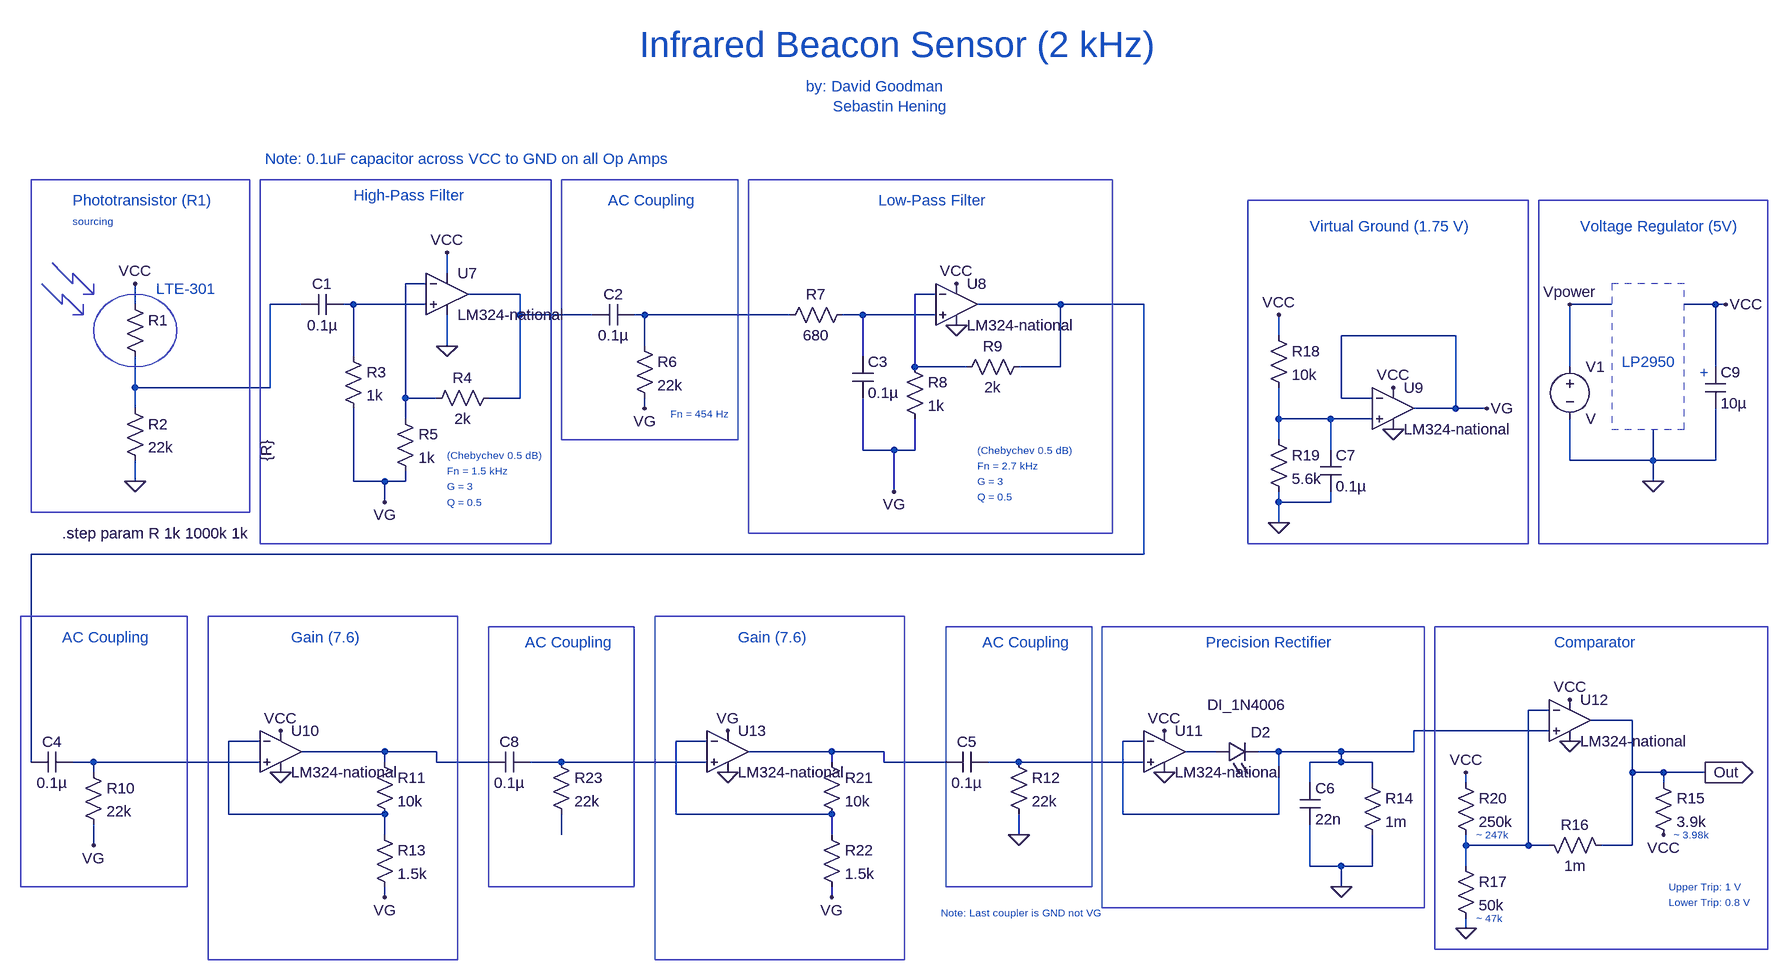
[diagram p0: schematic infrared_sensor.asc]
infrared_sensor.asc, the LTspice schematic file:
Version 4
SHEET 1 2516 1336
WIRE 448 192 448 160
WIRE 416 208 384 208
WIRE 560 224 480 224
WIRE 1200 224 1168 224
WIRE -32 240 -32 208
WIRE 224 240 176 240
WIRE 304 240 288 240
WIRE 416 240 304 240
WIRE 1392 240 1264 240
WIRE 1520 240 1392 240
WIRE 2240 240 2176 240
WIRE 2400 240 2352 240
WIRE 2416 240 2400 240
WIRE 560 256 560 224
WIRE 672 256 560 256
WIRE 752 256 736 256
WIRE 976 256 752 256
WIRE 1088 256 1056 256
WIRE 1200 256 1088 256
WIRE 1728 288 1728 256
WIRE 2000 288 1824 288
WIRE 448 304 448 256
WIRE 752 304 752 256
WIRE 304 320 304 240
WIRE 1088 320 1088 256
WIRE 1168 336 1168 224
WIRE 1248 336 1168 336
WIRE 1392 336 1392 240
WIRE 1392 336 1328 336
WIRE 2176 336 2176 240
WIRE 2400 336 2400 240
WIRE -32 368 -32 320
WIRE 176 368 176 240
WIRE 176 368 -32 368
WIRE 384 384 384 208
WIRE 432 384 384 384
WIRE 560 384 560 256
WIRE 560 384 512 384
WIRE 1824 384 1824 288
WIRE 1872 384 1824 384
WIRE -32 400 -32 368
WIRE 752 400 752 384
WIRE 2000 400 2000 288
WIRE 2000 400 1936 400
WIRE 2048 400 2000 400
WIRE 384 416 384 384
WIRE 1728 416 1728 368
WIRE 1808 416 1728 416
WIRE 1872 416 1808 416
WIRE 1728 448 1728 416
WIRE 1088 464 1088 384
WIRE 1136 464 1088 464
WIRE 1168 464 1168 416
WIRE 1168 464 1136 464
WIRE 1808 464 1808 416
WIRE 2176 480 2176 416
WIRE 2304 480 2304 432
WIRE 2304 480 2176 480
WIRE 2400 480 2400 400
WIRE 2400 480 2304 480
WIRE -32 512 -32 480
WIRE 304 512 304 400
WIRE 352 512 304 512
WIRE 384 512 384 496
WIRE 384 512 352 512
WIRE 2304 512 2304 480
WIRE 1136 528 1136 464
WIRE 352 544 352 512
WIRE 1728 544 1728 528
WIRE 1808 544 1808 528
WIRE 1808 544 1728 544
WIRE 1728 576 1728 544
WIRE 1520 624 1520 240
WIRE 1520 624 -192 624
WIRE 2144 864 2112 864
WIRE 2272 880 2208 880
WIRE 2144 896 1936 896
WIRE 160 912 112 912
WIRE 848 912 800 912
WIRE 1520 912 1488 912
WIRE 352 928 224 928
WIRE 432 928 352 928
WIRE 1040 928 912 928
WIRE 1120 928 1040 928
WIRE 1632 928 1584 928
WIRE 1728 928 1696 928
WIRE 1824 928 1728 928
WIRE 1936 928 1936 896
WIRE 1936 928 1824 928
WIRE -192 944 -192 624
WIRE -96 944 -128 944
WIRE 160 944 -96 944
WIRE 352 944 352 928
WIRE 432 944 432 928
WIRE 512 944 432 944
WIRE 624 944 576 944
WIRE 848 944 624 944
WIRE 1040 944 1040 928
WIRE 1120 944 1120 928
WIRE 1216 944 1120 944
WIRE 1328 944 1280 944
WIRE 1520 944 1328 944
WIRE 1824 944 1824 928
WIRE 1824 944 1776 944
WIRE 1872 944 1824 944
WIRE -96 960 -96 944
WIRE 2272 960 2272 880
WIRE 2320 960 2272 960
WIRE 2384 960 2320 960
WIRE 1776 976 1776 944
WIRE 1872 976 1872 944
WIRE 2016 976 2016 960
WIRE 2320 976 2320 960
WIRE 112 1024 112 912
WIRE 352 1024 112 1024
WIRE 800 1024 800 912
WIRE 1040 1024 800 1024
WIRE 1488 1024 1488 912
WIRE 1728 1024 1728 928
WIRE 1728 1024 1488 1024
WIRE 352 1056 352 1024
WIRE 624 1056 624 1024
WIRE 1040 1056 1040 1024
WIRE 1328 1056 1328 1024
WIRE -96 1072 -96 1040
WIRE 2016 1072 2016 1056
WIRE 2112 1072 2112 864
WIRE 2112 1072 2016 1072
WIRE 2144 1072 2112 1072
WIRE 2272 1072 2272 960
WIRE 2272 1072 2224 1072
WIRE 1776 1104 1776 1040
WIRE 1824 1104 1776 1104
WIRE 1872 1104 1872 1056
WIRE 1872 1104 1824 1104
WIRE 2016 1104 2016 1072
WIRE 1824 1136 1824 1104
WIRE 352 1152 352 1136
WIRE 1040 1152 1040 1136
WIRE 2016 1200 2016 1184
FLAG 352 544 VG
FLAG 1136 528 VG
FLAG -96 1072 VG
FLAG 752 400 VG
FLAG 352 1152 VG
FLAG 1824 1136 0
FLAG 2016 1200 0
FLAG 2320 1056 VCC
FLAG 2176 848 VCC
FLAG 1552 896 VCC
FLAG 1552 960 0
FLAG 2176 912 0
FLAG 192 960 0
FLAG 192 896 VCC
FLAG 1232 208 VCC
FLAG 448 160 VCC
FLAG 448 304 0
FLAG 1232 272 0
FLAG 2384 960 Out
IOPIN 2384 960 Out
FLAG -32 512 0
FLAG -32 208 VCC
FLAG 1728 576 0
FLAG 1728 256 VCC
FLAG 1904 432 0
FLAG 2048 400 VG
FLAG 2016 960 VCC
FLAG 1040 1152 VG
FLAG 880 960 0
FLAG 880 896 VG
FLAG 2416 240 VCC
FLAG 1328 1056 0
FLAG 2304 512 0
FLAG 1904 368 VCC
FLAG 2176 240 Vpower
SYMBOL res -48 224 R0
WINDOW 3 218 258 VLeft 2
SYMATTR Value {R}
SYMATTR InstName R1
SYMBOL res -48 384 R0
SYMATTR InstName R2
SYMATTR Value 22k
SYMBOL cap 288 224 R90
WINDOW 0 0 32 VBottom 2
WINDOW 3 32 32 VTop 2
SYMATTR InstName C1
SYMATTR Value 0.1µ
SYMBOL res 288 304 R0
SYMATTR InstName R3
SYMATTR Value 1k
SYMBOL res 528 368 R90
WINDOW 0 0 56 VBottom 2
WINDOW 3 32 56 VTop 2
SYMATTR InstName R4
SYMATTR Value 2k
SYMBOL res 368 400 R0
SYMATTR InstName R5
SYMATTR Value 1k
SYMBOL cap 736 240 R90
WINDOW 0 0 32 VBottom 2
WINDOW 3 32 32 VTop 2
SYMATTR InstName C2
SYMATTR Value 0.1µ
SYMBOL res 736 288 R0
SYMATTR InstName R6
SYMATTR Value 22k
SYMBOL res 1072 240 R90
WINDOW 0 0 56 VBottom 2
WINDOW 3 32 56 VTop 2
SYMATTR InstName R7
SYMATTR Value 680
SYMBOL cap 1072 320 R0
SYMATTR InstName C3
SYMATTR Value 0.1µ
SYMBOL res 1152 320 R0
SYMATTR InstName R8
SYMATTR Value 1k
SYMBOL res 1344 320 R90
WINDOW 0 0 56 VBottom 2
WINDOW 3 32 56 VTop 2
SYMATTR InstName R9
SYMATTR Value 2k
SYMBOL cap -192 928 M90
WINDOW 0 0 32 VBottom 2
WINDOW 3 32 32 VTop 2
SYMATTR InstName C4
SYMATTR Value 0.1µ
SYMBOL res -112 944 R0
SYMATTR InstName R10
SYMATTR Value 22k
SYMBOL res 336 928 R0
SYMATTR InstName R11
SYMATTR Value 10k
SYMBOL cap 1216 928 M90
WINDOW 0 0 32 VBottom 2
WINDOW 3 32 32 VTop 2
SYMATTR InstName C5
SYMATTR Value 0.1µ
SYMBOL res 1312 928 R0
SYMATTR InstName R12
SYMATTR Value 22k
SYMBOL res 336 1040 R0
SYMATTR InstName R13
SYMATTR Value 1.5k
SYMBOL LED 1632 944 R270
WINDOW 0 30 68 VTop 2
WINDOW 3 104 47 VBottom 2
SYMATTR InstName D2
SYMATTR Value DI_1N4006
SYMATTR Description Diode
SYMATTR Type diode
SYMBOL cap 1760 976 R0
SYMATTR InstName C6
SYMATTR Value 22n
SYMBOL res 1856 960 R0
SYMATTR InstName R14
SYMATTR Value 1m
SYMBOL res 2304 960 R0
SYMATTR InstName R15
SYMATTR Value 3.9k
SYMBOL res 2128 1056 M90
WINDOW 0 0 56 VBottom 2
WINDOW 3 32 56 VTop 2
SYMATTR InstName R16
SYMATTR Value 1m
SYMBOL res 2000 1088 R0
SYMATTR InstName R17
SYMATTR Value 50k
SYMBOL res 1712 272 R0
SYMATTR InstName R18
SYMATTR Value 10k
SYMBOL res 1712 432 R0
SYMATTR InstName R19
SYMATTR Value 5.6k
SYMBOL res 2000 960 R0
SYMATTR InstName R20
SYMATTR Value 250k
SYMBOL cap 1792 464 R0
SYMATTR InstName C7
SYMATTR Value 0.1µ
SYMBOL LM324-national 448 160 R0
SYMATTR InstName U7
SYMBOL LM324-national 1232 176 R0
SYMATTR InstName U8
SYMBOL LM324-national 1904 336 R0
SYMATTR InstName U9
SYMBOL LM324-national 192 864 R0
SYMATTR InstName U10
SYMBOL LM324-national 1552 864 R0
SYMATTR InstName U11
SYMBOL LM324-national 2176 816 R0
SYMATTR InstName U12
SYMBOL res 1024 928 R0
SYMATTR InstName R21
SYMATTR Value 10k
SYMBOL res 1024 1040 R0
SYMATTR InstName R22
SYMATTR Value 1.5k
SYMBOL LM324-national 880 864 R0
SYMATTR InstName U13
SYMBOL cap 512 928 M90
WINDOW 0 0 32 VBottom 2
WINDOW 3 32 32 VTop 2
SYMATTR InstName C8
SYMATTR Value 0.1µ
SYMBOL res 608 928 R0
SYMATTR InstName R23
SYMATTR Value 22k
SYMBOL voltage 2176 320 R0
SYMATTR InstName V1
SYMBOL cap 2384 336 R0
SYMATTR InstName C9
SYMATTR Value 10µ
TEXT 208 752 Left 2 ;Gain (7.6)
TEXT 1616 760 Left 2 ;Precision Rectifier
TEXT 1272 760 Left 2 ;AC Coupling
TEXT -144 752 Left 2 ;AC Coupling
TEXT 696 80 Left 2 ;AC Coupling
TEXT 1112 80 Left 2 ;Low-Pass Filter
TEXT 1264 464 Left 1 ;(Chebychev 0.5 dB)
TEXT 1264 488 Left 1 ;Fn = 2.7 kHz
TEXT 1264 512 Left 1 ;G = 3
TEXT 1264 536 Left 1 ;Q = 0.5
TEXT 792 408 Left 1 ;Fn = 454 Hz
TEXT 304 72 Left 2 ;High-Pass Filter
TEXT 448 496 Left 1 ;Fn = 1.5 kHz
TEXT 448 472 Left 1 ;(Chebychev 0.5 dB)
TEXT 448 520 Left 1 ;G = 3
TEXT 448 544 Left 1 ;Q = 0.5
TEXT 1776 120 Left 2 ;Virtual Ground (1.75 V)
TEXT 2152 760 Left 2 ;Comparator
TEXT 2328 1160 Left 1 ;Lower Trip: 0.8 V
TEXT 2328 1136 Left 1 ;Upper Trip: 1 V
TEXT -128 80 Left 2 ;Phototransistor (R1)
TEXT -128 112 Left 1 ;sourcing
TEXT -144 592 Left 2 !.step param R 1k 1000k 1k
TEXT 896 752 Left 2 ;Gain (7.6)
TEXT 568 760 Left 2 ;AC Coupling
TEXT 0 216 Left 2 ;LTE-301
TEXT 168 16 Left 2 ;Note: 0.1uF capacitor across VCC to GND on all Op Amps
TEXT 2256 328 Left 2 ;LP2950
TEXT 2192 120 Left 2 ;Voltage Regulator (5V)
TEXT 1208 1176 Left 1 ;Note: Last coupler is GND not VG
TEXT 2032 1184 Left 1 ;~ 47k
TEXT 2032 1056 Left 1 ;~ 247k
TEXT 2336 1056 Left 1 ;~ 3.98k
TEXT 2376 344 Left 2 ;+
TEXT 744 -160 Left 5 ;Infrared Beacon Sensor (2 kHz)
TEXT 1000 -96 Left 2 ;by: David Goodman\n      Sebastin Hening
LINE Normal -144 240 -160 224
LINE Normal -144 224 -144 240
LINE Normal -128 240 -144 224
LINE Normal -128 208 -144 192
LINE Normal -128 192 -128 208
LINE Normal -112 208 -128 192
LINE Normal -96 224 -112 208
LINE Normal -112 256 -128 240
LINE Normal -112 240 -112 256
LINE Normal -128 256 -112 256
LINE Normal -96 224 -96 208
LINE Normal -112 224 -96 224
LINE Normal -176 208 -160 224
LINE Normal -160 176 -144 192
RECTANGLE Normal 144 560 -192 48
RECTANGLE Normal 608 608 160 48
RECTANGLE Normal 896 448 624 48
RECTANGLE Normal 1472 592 912 48
RECTANGLE Normal 1440 1136 1216 736
RECTANGLE Normal 1952 1168 1456 736
RECTANGLE Normal 2480 1232 1968 736
RECTANGLE Normal 48 720 -208 1136
RECTANGLE Normal 464 720 80 1248
RECTANGLE Normal 1152 720 768 1248
RECTANGLE Normal 736 1136 512 736
RECTANGLE Normal 2112 608 1680 80
RECTANGLE Normal 2480 608 2128 80
RECTANGLE Normal 2240 432 2352 208 2
CIRCLE Normal 32 224 -96 336

The netlist it stands for:
* infrared_sensor.asc
R1 VCC N004 {R}
R2 N004 0 22k
C1 N005 N004 0.1µ
R3 N005 VG 1k
R4 N002 N001 2k
R5 N001 VG 1k
C2 N007 N002 0.1µ
R6 N007 VG 22k
R7 N008 N007 680
C3 N008 VG 0.1µ
R8 N003 VG 1k
R9 N006 N003 2k
C4 N006 N017 0.1µ
R10 N017 VG 22k
R11 N014 N012 10k
C5 N015 N019 0.1µ
R12 N019 0 22k
R13 N012 VG 1.5k
D2 N016 N011 DI_1N4006
C6 N011 0 22n
R14 N011 0 1m
R15 Out VCC 3.9k
R16 N010 Out 1m
R17 N010 0 50k
R18 VCC N009 10k
R19 N009 0 5.6k
R20 VCC N010 250k
C7 N009 0 0.1µ
* U7: LM324-national (symbol LM324-national not available, pins judged from their places): In+=N005 In-=N001 V+=VCC V-=0 OUT=N002
* U8: LM324-national (symbol LM324-national not available, pins judged from their places): In+=N008 In-=N003 V+=VCC V-=0 OUT=N006
* U9: LM324-national (symbol LM324-national not available, pins judged from their places): In+=N009 In-=VG V+=VCC V-=0 OUT=VG
* U10: LM324-national (symbol LM324-national not available, pins judged from their places): In+=N017 In-=N012 V+=VCC V-=0 OUT=N014
* U11: LM324-national (symbol LM324-national not available, pins judged from their places): In+=N019 In-=N011 V+=VCC V-=0 OUT=N016
* U12: LM324-national (symbol LM324-national not available, pins judged from their places): In+=N011 In-=N010 V+=VCC V-=0 OUT=Out
R21 N015 N013 10k
R22 N013 VG 1.5k
* U13: LM324-national (symbol LM324-national not available, pins judged from their places): In+=N018 In-=N013 V+=VG V-=0 OUT=N015
C8 N014 N018 0.1µ
R23 N018 N020 22k
V1 Vpower 0 V
C9 VCC 0 10µ
.model D D
.lib standard.dio
* Gain (7.6)
* Precision Rectifier
* AC Coupling
* AC Coupling
* AC Coupling
* Low-Pass Filter
* (Chebychev 0.5 dB)
* Fn = 2.7 kHz
* G = 3
* Q = 0.5
* Fn = 454 Hz
* High-Pass Filter
* Fn = 1.5 kHz
* (Chebychev 0.5 dB)
* G = 3
* Q = 0.5
* Virtual Ground (1.75 V)
* Comparator
* Lower Trip: 0.8 V
* Upper Trip: 1 V
* Phototransistor (R1)
* sourcing
.step param R 1k 1000k 1k
* Gain (7.6)
* AC Coupling
* LTE-301
* Note: 0.1uF capacitor across VCC to GND on all Op Amps
* LP2950
* Voltage Regulator (5V)
* Note: Last coupler is GND not VG
* ~ 47k
* ~ 247k
* ~ 3.98k
* +
* Infrared Beacon Sensor (2 kHz)
* by: David Goodman
*       Sebastin Hening
.backanno
.end